# Altium schematic sheet BMS028B_PinConfig.SchDoc: Pin Configuration
size 431 x 279 mm; Date: Not shown in title block; ApprovedBy: Not shown in title block; CheckedBy: Not shown in title block; Author: Not shown in title block; CompanyName: Not shown in title block; DrawnBy: M Sunna; Engineer: Not shown in title block; Organization: Not shown in title block; Address1: Not shown in title block; Address2: Not shown in title block; Address3: Not shown in title block; Address4: Not shown in title block; DocumentNumber: 2; Revision: Use project parameter SCH_Rev; SheetNumber: 2; SheetTotal: 5; PageSetup: Record=PageOptions|CenterHorizontal=True|CenterVertical=True|PrintScale=1.00|XCorrection=1.00|YCorrection=1.00|PrintKind=0|BorderSize=5000000|LeftOffset=0|BottomOffset=0|Orientation=2|PaperLength=1000|PaperWidth=1000|Scale=100|PaperSource=15|PrintQuality=600|MediaType=1|DitherType=10|PaperKind=Letter|PrintScaleMode=1; CurrentTime: Not shown in title block; CurrentDate: Not shown in title block; Time: Not shown in title block; DocumentFullPathAndName: Not shown in title block; DocumentName: Not shown in title block; ModifiedDate: Not shown in title block; ImagePath: Not shown in title block
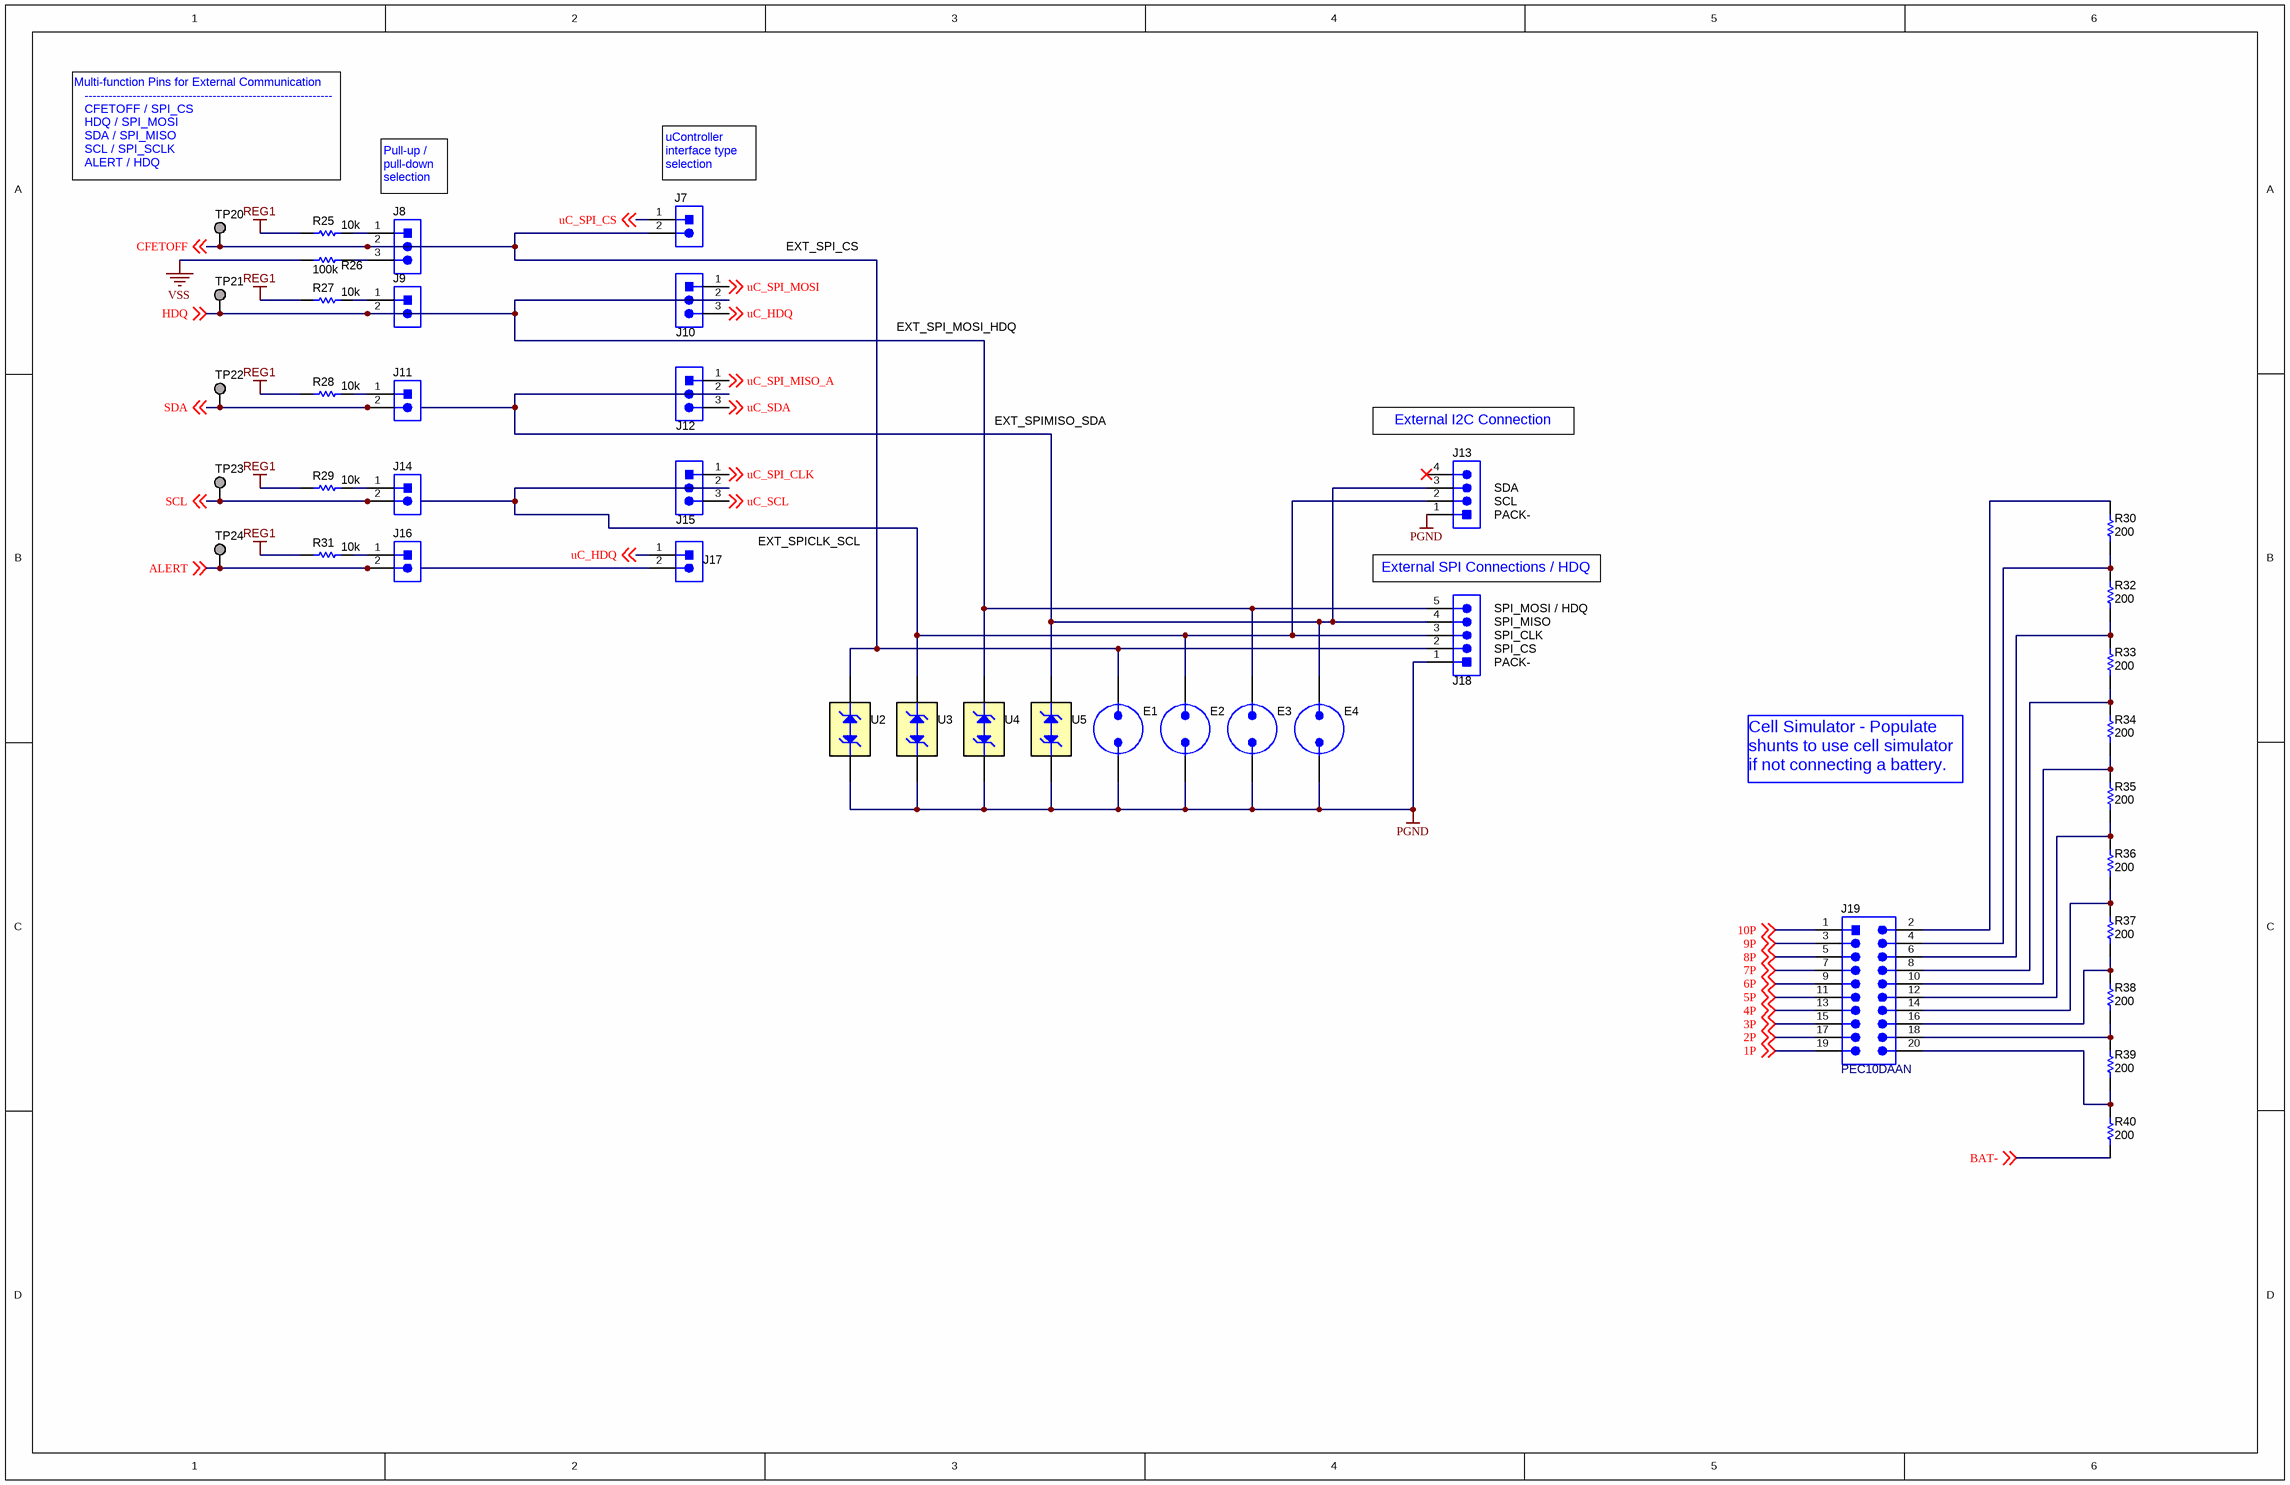
[diagram p0: BMS028B_PinConfig.SchDoc]

## Parts
E1  Spark Gap  [SPARK_GAP2]  (value not drawn)  (no BOM)
E2  Spark Gap  [SPARK_GAP2]  (value not drawn)  (no BOM)
E3  Spark Gap  [SPARK_GAP2]  (value not drawn)  (no BOM)
E4  Spark Gap  [SPARK_GAP2]  (value not drawn)  (no BOM)
J7  PEC02SAAN  [CONN_PEC02SAAN]  (value not drawn)
J8  87898-0304  [Molex_87898-0304]  (value not drawn)
J9  PEC02SAAN  [CONN_PEC02SAAN]  (value not drawn)
J10  87898-0304  [Molex_87898-0304]  (value not drawn)
J11  PEC02SAAN  [CONN_PEC02SAAN]  (value not drawn)
J12  87898-0304  [Molex_87898-0304]  (value not drawn)
J13  22/05/3041  [CONN_22-05-3041]  (value not drawn)
J14  PEC02SAAN  [CONN_PEC02SAAN]  (value not drawn)
J15  87898-0304  [Molex_87898-0304]  (value not drawn)
J16  PEC02SAAN  [CONN_PEC02SAAN]  (value not drawn)
J17  PEC02SAAN  [CONN_PEC02SAAN]  (value not drawn)
J18  PEC05SAAN  [Sullins_PxC05SAAN]  (value not drawn)
J19  PEC10DAAN  [SULLINS_PEC10DAAN]
R25  ValueDisplayed: 10k  [0603]  (hidden comment: CRCW060310K0JNEA)
R26  ValueDisplayed: 100k  [0603]  (hidden comment: CRCW0603100KJNEA)
R27  ValueDisplayed: 10k  [0603]  (hidden comment: CRCW060310K0JNEA)
R28  ValueDisplayed: 10k  [0603]  (hidden comment: CRCW060310K0JNEA)
R29  ValueDisplayed: 10k  [0603]  (hidden comment: CRCW060310K0JNEA)
R30  ValueDisplayed: 200  [1206]  (hidden comment: CRCW1206200RFKEA)
R31  ValueDisplayed: 10k  [0603]  (hidden comment: CRCW060310K0JNEA)
R32  ValueDisplayed: 200  [1206]  (hidden comment: CRCW1206200RFKEA)
R33  ValueDisplayed: 200  [1206]  (hidden comment: CRCW1206200RFKEA)
R34  ValueDisplayed: 200  [1206]  (hidden comment: CRCW1206200RFKEA)
R35  ValueDisplayed: 200  [1206]  (hidden comment: CRCW1206200RFKEA)
R36  ValueDisplayed: 200  [1206]  (hidden comment: CRCW1206200RFKEA)
R37  ValueDisplayed: 200  [1206]  (hidden comment: CRCW1206200RFKEA)
R38  ValueDisplayed: 200  [1206]  (hidden comment: CRCW1206200RFKEA)
R39  ValueDisplayed: 200  [1206]  (hidden comment: CRCW1206200RFKEA)
R40  ValueDisplayed: 200  [1206]  (hidden comment: CRCW1206200RFKEA)
TP20  TESTPOINT  [TP_50MIL-25MILHOLE]  (value not drawn)  (no BOM)
TP21  TESTPOINT  [TP_50MIL-25MILHOLE]  (value not drawn)  (no BOM)
TP22  TESTPOINT  [TP_50MIL-25MILHOLE]  (value not drawn)  (no BOM)
TP23  TESTPOINT  [TP_50MIL-25MILHOLE]  (value not drawn)  (no BOM)
TP24  TESTPOINT  [TP_50MIL-25MILHOLE]  (value not drawn)  (no BOM)
U2  TPD1E10B06DPYR  [DPY0002A]  (value not drawn)
U3  TPD1E10B06DPYR  [DPY0002A]  (value not drawn)
U4  TPD1E10B06DPYR  [DPY0002A]  (value not drawn)
U5  TPD1E10B06DPYR  [DPY0002A]  (value not drawn)

## Nets
PGND: E1.2 E2.2 E3.2 E4.2 J13.1 J18.1 U2.2(A) U3.2(A) U4.2(A) U5.2(A)
REG1: R25.1 R27.1 R28.1 R29.1 R31.1
VSS: R26.1
1P: J19.19 ; off-sheet 1P
2P: J19.17 ; off-sheet 2P
3P: J19.15 ; off-sheet 3P
4P: J19.13 ; off-sheet 4P
5P: J19.11 ; off-sheet 5P
6P: J19.9 ; off-sheet 6P
7P: J19.7 ; off-sheet 7P
8P: J19.5 ; off-sheet 8P
9P: J19.3 ; off-sheet 9P
10P: J19.1 ; off-sheet 10P
ALERT: J16.2 J17.2 TP24.1 ; off-sheet ALERT
BAT-: R40.1 ; off-sheet BAT-
CFETOFF: E1.1 J7.2 J8.2 J18.2 TP20.1 U2.1(K) ; off-sheet CFETOFF
HDQ: E3.1 J9.2 J10.2 J18.5 TP21.1 U4.1(K) ; off-sheet HDQ
SCL: E2.1 J13.2 J14.2 J15.2 J18.3 TP23.1 U3.1(K) ; off-sheet SCL
SDA: E4.1 J11.2 J12.2 J13.3 J18.4 TP22.1 U5.1(K) ; off-sheet SDA
uC_HDQ: J10.3 J17.1 ; off-sheet uC_HDQ
uC_SCL: J15.3 ; off-sheet uC_SCL
uC_SDA: J12.3 ; off-sheet uC_SDA
uC_SPI_CLK: J15.1 ; off-sheet uC_SPI_CLK
uC_SPI_CS: J7.1 ; off-sheet uC_SPI_CS
uC_SPI_MISO_A: J12.1 ; off-sheet uC_SPI_MISO_A
uC_SPI_MOSI: J10.1 ; off-sheet uC_SPI_MOSI
NetJ8_1: J8.1 R25.2
NetJ8_3: J8.3 R26.2
NetJ9_1: J9.1 R27.2
NetJ11_1: J11.1 R28.2
NetJ14_1: J14.1 R29.2
NetJ16_1: J16.1 R31.2
NetJ19_2: J19.2 R30.2
NetJ19_4: J19.4 R30.1 R32.2
NetJ19_6: J19.6 R32.1 R33.2
NetJ19_8: J19.8 R33.1 R34.2
NetJ19_10: J19.10 R34.1 R35.2
NetJ19_12: J19.12 R35.1 R36.2
NetJ19_14: J19.14 R36.1 R37.2
NetJ19_16: J19.16 R37.1 R38.2
NetJ19_18: J19.18 R38.1 R39.2
NetJ19_20: J19.20 R39.1 R40.2

Not connected (* = marked no-connect by the designer): J13 4*

## Notes on the sheet
- Multi-function Pins for External Communication
  --------------------------------------------------------------
  CFETOFF / SPI_CS
  HDQ / SPI_MOSI
  SDA / SPI_MISO
  SCL / SPI_SCLK
  ALERT / HDQ
- Pull-up / pull-down selection
- (near J7) uController interface type selection
- EXT_SPI_CS
- EXT_SPI_MOSI_HDQ
- EXT_SPIMISO_SDA
- (near J13) External I2C Connection
- (near J13) SDA
- (near J13) SCL
- EXT_SPICLK_SCL
- (near J13) PACK-
- External SPI Connections / HDQ
- (near J18) SPI_MISO
- (near J18) SPI_MOSI / HDQ
- (near J18) SPI_CLK
- (near J18) SPI_CS
- (near J18) PACK-
- Cell Simulator - Populate shunts to use cell simulator if not connecting a battery.

## Library data of the parts
E1-E4 = CMP-0079939-1: CompType: Spark Gap
J7 J9 J11 J14 J16 J17 = CMP-0002337-1: Header, 100mil, 2x1, Tin, TH; Manufacturer: Sullins Connector Solutions; CNHeader: TRUE; Current_A: 3A; Green_Lifecycle: Not Set; Shrouded: N; Gender: Male; Green_REACh: Incomplete; Voltage_V: 1.8kV; Row_Count: 1; Pitch_mm: 2.54; CT: FALSE; Cert_UL: Y; ComponentLink1URL: http://www.sullinscorp.com/catalogs/77_PAGE108-109_.100_MALE_HDR.pdf; ClassName: Header; Publisher: Texas Instruments; Color: Black; RoHS: Y; MountType: TH; Green_EU RoHS-2: Incomplete; Supplier 1: Digi-Key; Green_EU RoHS: Incomplete; PackageReference: Header, 2 PIN, 100mil, Tin; PinCount: 2; CompType: Header; LatestRevisionDate: 26/05/2017; PartNumber: PEC02SAAN; Orientation: Vertical; ComponentLink1Description: Datasheet URL; Supplier Part Number 1: S1012E-02-ND; ContactFinish: Tin
J8 J10 J12 J15 = CMP-0075388-1: Header, 2.54mm, 3x1, Gold, SMT; Manufacturer: Molex; Pitch_mm: 2.54; Gender: Male; Cert_CSA: Y; Current_A: 3A; Voltage_V: 250V; CT: False; Shrouded: N; Row_Count: 1; CNHeader: True; ComponentLink1Description: Datasheet URL; RoHS: Y; Supplier Part Number 3: 538-87898-0304; Supplier 1: Digi-Key; Cert_UL: Y; Orientation: Vertical; PackageReference: Header, 2.54mm, 3x1, SMT; Color: Black; PartNumber: 87898-0304; PinCount: 3; Publisher: Texas Instruments; Supplier Part Number 2: 39T3063; ContactFinish: Gold; Supplier 2: Newark; ClassName: Header; ComponentLink1URL: http://www.molex.com/pdm_docs/sd/878980204_sd.pdf; LatestRevisionDate: 2017-07-14; CompType: Header; MountType: SMT; Supplier Part Number 1: 0878980304-ND; Supplier 3: Mouser
J13 = CMP-0055187-1: Header (friction lock), 100mil, 4x1, R/A, TH; Manufacturer: Molex; Green_Lifecycle: Active; Green_REACh: Passed; CNHeader: FALSE; ComponentLink1URL: http://www.molex.com/pdm_docs/sd/022053041_sd.pdf; PackageReference: 4x1 R/A Header; PartNumber: 22/05/3041; ComponentLink1Description: Datasheet URL; CompType: Header; RoHS: Y; MountType: TH; Publisher: Texas Instruments; LatestRevisionDate: 26/05/2017; Supplier 1: Digi-Key; Supplier Part Number 1: WM4302-ND; Supplier 2: Newark; Supplier Part Number 2: 27C1932; Supplier 3: Mouser; Supplier Part Number 3: 538-22-05-3041; Green_EU RoHS: Passed; Green_EU RoHS-2: Passed; CT: FALSE
J18 = CMP-0054597-1: Header, 2.54mm, 5x1, Tin, TH; Manufacturer: Sullins Connector Solutions; CNHeader: TRUE; Current_A: 3A; Green_Lifecycle: Not Set; Shrouded: N; Gender: Male; Green_REACh: Incomplete; Voltage_V: 1.8kV; Row_Count: 1; Pitch_mm: 2.54; CT: FALSE; Cert_UL: Y; ComponentLink1URL: http://www.sullinscorp.com/catalogs/77_PAGE108-109_.100_MALE_HDR.pdf; ClassName: Header; Publisher: Texas Instruments; Color: Black; RoHS: Y; MountType: TH; Green_EU RoHS-2: Incomplete; Supplier 1: Digi-Key; Green_EU RoHS: Incomplete; PackageReference: Header, 2.54mm, 5x1, TH; PinCount: 5; CompType: Header; LatestRevisionDate: 26/05/2017; PartNumber: PEC05SAAN; Orientation: Vertical; ComponentLink1Description: Datasheet URL; Supplier Part Number 1: S1012E-05-ND; ContactFinish: Tin
J19 = CMP-0054623-2: Header, 2.54mm, 10x2, Tin, TH; Manufacturer: Sullins Connector Solutions; Current_A: 3A; Green_Lifecycle: Not Set; Shrouded: N; Gender: Male; Green_REACh: Incomplete; Row_Count: 2; RowSpacing_mm: 2.54; Cert_UL: Y; ComponentLink1URL: https://drawings-pdf.s3.amazonaws.com/C10419.pdf; ClassName: Header; Color: Black; RoHS: Y; MountType: TH; Green_EU RoHS-2: Incomplete; Supplier 1: Digi-Key; Green_EU RoHS: Incomplete; PackageReference: Header, 10x2, 2.54mm, TH; PinCount: 20; CompType: Header; PartNumber: PEC10DAAN; Orientation: Vertical; ComponentLink1Description: Datasheet URL; Supplier Part Number 1: S2012E-10-ND; Pitch_mm: 2.54; ContactFinish: Tin
R25 R27-R29 R31 = CMP-0025701-4: RES, 10 k, 5%, 0.1 W, AEC-Q200 Grade 0, 0603; Manufacturer: Vishay-Dale; Power_W: 100mW; TempCo: 200 ppm/C; Value_Code: 10k0; Value: 10k; EIA_Code: E24; SizeX_mm: 1.6; SizeY_mm: 0.8; SizeZ_mm: 1; Value2: 0.1W; SizeArea_mm2: 1.28; CompType: Resistor; AEC Qualified: Y; VDC_V: 75V; AEC Category: Q200; AEC Grade: 0; Supplier Part Number 2: 52K8066; Supplier 2: Newark; Supplier Part Number 3: 71-CRCW0603J-10K-E3; Supplier 3: Mouser; RoHS: E; Value1: 5%; MountType: SMT; Supplier 1: Digi-Key; PackageReference: 0603; Tolerance_%: 5%; Res_ohm: 10k; PartNumber: CRCW060310K0JNEA; ComponentLink1Description: Datasheet link; Supplier Part Number 1: 541-10KGCT-ND; Technology: Thick Film; ComponentLink1URL: http://www.vishay.com/docs/20035/dcrcwe3.pdf
R26 = CMP-0025698-4: RES, 100 k, 5%, 0.1 W, AEC-Q200 Grade 0, 0603; Manufacturer: Vishay-Dale; Power_W: 100mW; TempCo: 200 ppm/C; Value: 100k; EIA_Code: E24; SizeX_mm: 1.6; SizeY_mm: 0.8; SizeZ_mm: 1; Value2: 0.1W; SizeArea_mm2: 1.28; AEC Qualified: Y; VDC_V: 75V; AEC Category: Q200; AEC Grade: 0; Supplier Part Number 2: 59M6763; Supplier 2: Newark; Supplier Part Number 3: 71-CRCW0603J-100K-E3; Supplier 3: Mouser; Value_Code: 100k; RoHS: E; Value1: 5%; MountType: SMT; Supplier 1: Digi-Key; PackageReference: 0603; Tolerance_%: 5%; Res_ohm: 100k; CompType: Resistor; PartNumber: CRCW0603100KJNEA; ComponentLink1Description: Datasheet link; Supplier Part Number 1: 541-100KGCT-ND; Technology: Thick Film; ComponentLink1URL: http://www.vishay.com/docs/20035/dcrcwe3.pdf
R30 R32-R40 = CMP-0016776-3: RES, 200, 1%, 0.25 W, AEC-Q200 Grade 0, 1206; Manufacturer: Vishay-Dale; Power_W: 250mW; TempCo: 100 ppm/C; Value_Code: 200R; Value: 200; EIA_Code: E96; SizeX_mm: 3.2; SizeY_mm: 1.6; SizeZ_mm: 1.35; Value2: 0.25W; SizeArea_mm2: 5.12; AEC Qualified: Y; VDC_V: 200V; AEC Category: Q200; AEC Grade: 0; Supplier Part Number 2: 53K2137; Supplier 2: Newark; Supplier Part Number 3: 71-CRCW1206-200-E3; Supplier 3: Mouser; RoHS: E; Value1: 1%; MountType: SMT; Supplier 1: Digi-Key; PackageReference: 1206; Tolerance_%: 1%; Res_ohm: 200; CompType: Resistor; PartNumber: CRCW1206200RFKEA; ComponentLink1Description: Datasheet link; Supplier Part Number 1: 541-200FCT-ND; Technology: Thick Film; ComponentLink1URL: http://www.vishay.com/docs/20035/dcrcwe3.pdf
TP20-TP24 = CMP-0078143-2: TEST POINT.  No entry in BOM.; PartNumber: N/A; CompType: Testpoint; Manufacturer: N/A; PackageReference: N/A; Library Reference: TESTPOINT
U2-U5 = CMP-0043093-3: Single-Channel ESD in 0402 Package With 10pF Capacitance and 6V Breakdown, DPY0002A (X1SON-2); Manufacturer: Texas Instruments; Alternate PartNumber: TPD1E10B06DPYT; IEC 61000-4-2 Air-Gap(+/- kV): 30; Eco-Plan: TBD; IO Capacitance(Typ)(pF): 10; Breakdown Voltage(Min)(V): 6; AEC Category: Q200; AEC Qualified: N; CompType: IC; Green_Lifecycle: Active; Green_REACh: Passed; SizeAreaWB_mm2: 3.2; SizeArea_mm2: 0.6; SizeX_mm: 1.0; SizeZ_mm: 0.45; Rating: Catalog; ComponentLink3Description: Online Datasheet; PackageReference: DPY0002A; PackageDescription: X1SON-2; ComponentLink2URL: http://www.ti.com/product/tpd1e10b06; ComponentLink1URL: http://www.ti.com/lit/ds/symlink/tpd1e10b06.pdf; ComponentLink3URL: http://www.ti.com/product/tpd1e10b06/datasheet; IO Leakage Current(nA): 10; ComponentLink1Description: Datasheet Link; ComponentLink2Description: Product Folder; PartNumber: TPD1E10B06DPYR; IEC 61000-4-2 Contact(+/- kV): 30; Alternate Manufacturer: Texas Instruments; Green_EU RoHS: Passed; Green_EU RoHS-2: Passed; MountType: SMT; RoHS: Y; SizeY_mm: 0.6; Operating Temperature Range: -40 to 125 C